# EAGLE design lund (EAGLE 5.10)

## Sheet 1 of 2
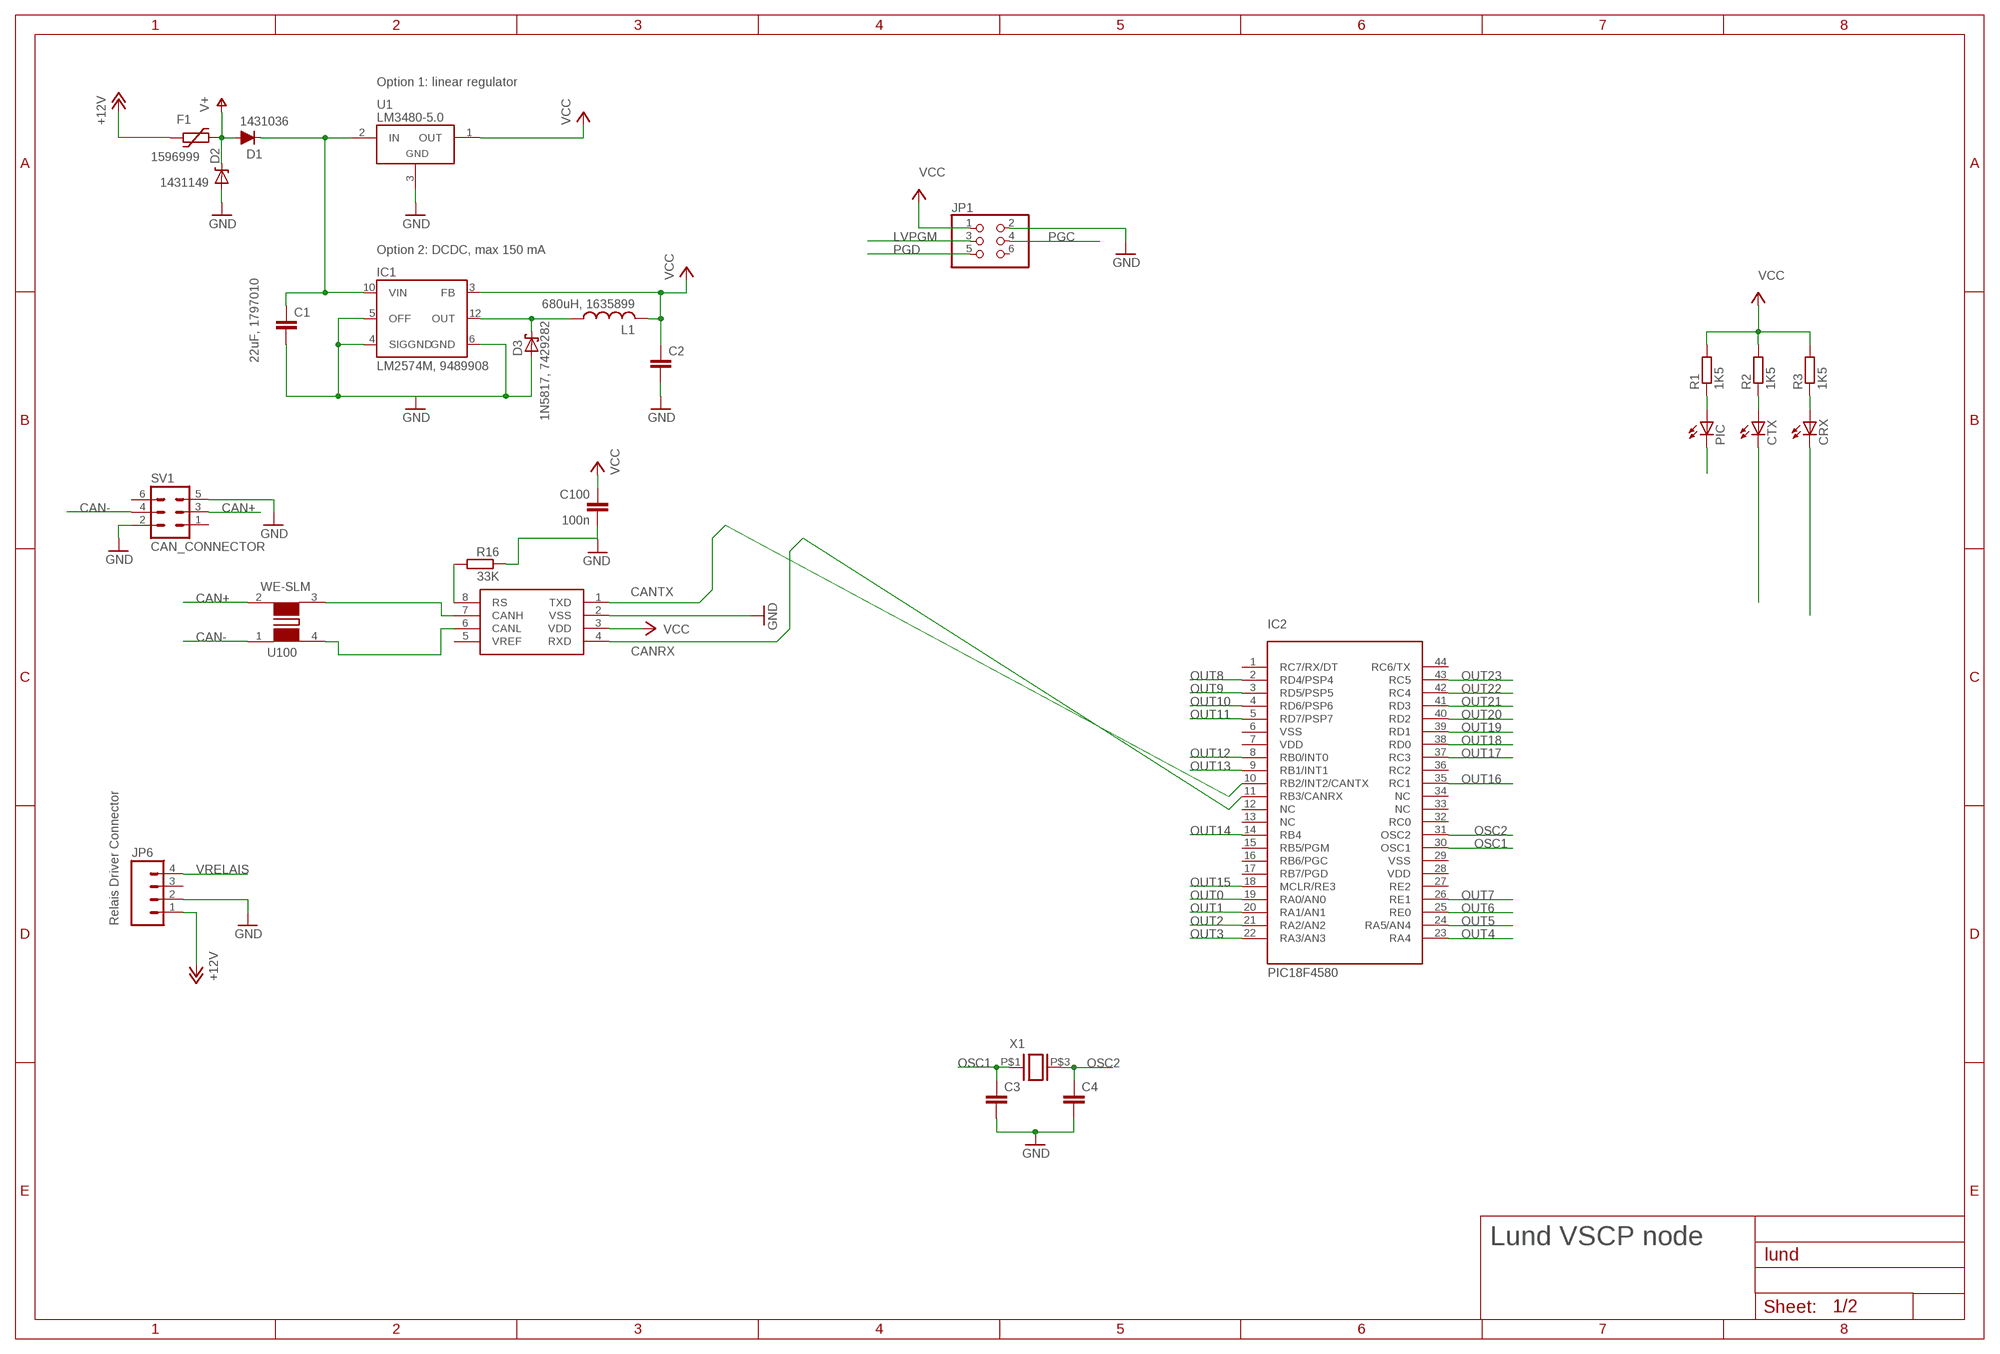
[diagram p0: schematic, sheet 1]

### Parts
C1  22uF, 1797010  C-EUC1206K  [C1206K]
C2  C-EUC1210K  [C1210K]
C3  CAP0603-CAP  [0603-CAP]
C4  CAP0603-CAP  [0603-CAP]
C100  100n  C-EUC0805  [C0805]
CRX  LEDCHIPLED_0805  [CHIPLED_0805]
CTX  LEDCHIPLED_0805  [CHIPLED_0805]
D1  1431036  D-FILL-SOD123  [SOD123]
D2  1431149  DIODE-ZENER403D-02  [403D-02]
D3  1N5817, 7429282  1N5817-B  [DO41-7.6]
F1  1596999  1812L  [1812L]
IC1  LM2574M, 9489908  LM2574M  [SO14W]
IC2  PIC18F4580  [TQFP44]
JP1  PINHD-2X3  [2X03]
JP6  M04SIDE_EDGE_5.08  [CAMDEN_BOSS_1X4_OPEN]
L1  680uH, 1635899  L-USWE-TPC  [POWER-CHOKE_WE-TPC]
PIC  LEDCHIPLED_0805  [CHIPLED_0805]
R1  1K5  R-EU_R0805  [R0805]
R2  1K5  R-EU_R0805  [R0805]
R3  1K5  R-EU_R0805  [R0805]
R16  33K  R-EU_R0805  [R0805]
SV1  CAN_CONNECTOR  ML6L  [ML6L]
U1  LM3480-5.0  [SOT-23-3]
U2  MCP2551  [SO08]
U100  WE-SLM  [WE-SLM]
X1  1611798  ABRACON_CRYSTAL  [QUARTZ_CRYSTAL]

### Nets
+12V: F1.P$1 JP6.1
CAN+: SV1.3 U100.2
CAN-: SV1.4 U100.1
CANRX: CRX.C IC2.11(RB3/CANRX) U2.4(RXD)
CANTX: CTX.C IC2.10(RB2/INT2/CANTX) U2.1(TXD)
GND: C2.2 C3.2 C4.2 C100.2 D2.P$2(A) JP1.2 JP6.2 R16.1 SV1.2 SV1.5 U1.3(GND) U2.2(VSS) ; also sheet 2
LVPGM: JP1.3
N$2: U2.7(CANH) U100.3
N$4: C1.1 D1.1(C) IC1.10(VIN) U1.2(IN)
N$7: R16.2 U2.8(RS)
N$9: C1.2 D3.A IC1.4(SIGGND) IC1.5(OFF) IC1.6(GND)
N$10: PIC.C
N$11: PIC.A R1.1
N$12: CTX.A R2.1
N$14: CRX.A R3.1
N$16: D3.C IC1.12(OUT) L1.1
N$25: U2.6(CANL) U100.4
OSC1: C3.1 IC2.30(OSC1) X1.P$1
OSC2: C4.1 IC2.31(OSC2) X1.P$3
OUT0: IC2.19(RA0/AN0) ; also sheet 2
OUT1: IC2.20(RA1/AN1) ; also sheet 2
OUT2: IC2.21(RA2/AN2) ; also sheet 2
OUT3: IC2.22(RA3/AN3) ; also sheet 2
OUT4: IC2.23(RA4) ; also sheet 2
OUT5: IC2.24(RA5/AN4) ; also sheet 2
OUT6: IC2.25(RE0) ; also sheet 2
OUT7: IC2.26(RE1) ; also sheet 2
OUT8: IC2.2(RD4/PSP4) ; also sheet 2
OUT9: IC2.3(RD5/PSP5) ; also sheet 2
OUT10: IC2.4(RD6/PSP6) ; also sheet 2
OUT11: IC2.5(RD7/PSP7) ; also sheet 2
OUT12: IC2.8(RB0/INT0) ; also sheet 2
OUT13: IC2.9(RB1/INT1) ; also sheet 2
OUT14: IC2.14(RB4) ; also sheet 2
OUT15: IC2.18(MCLR/RE3) ; also sheet 2
OUT16: IC2.35(RC1) ; also sheet 2
OUT17: IC2.37(RC3) ; also sheet 2
OUT18: IC2.38(RD0) ; also sheet 2
OUT19: IC2.39(RD1) ; also sheet 2
OUT20: IC2.40(RD2) ; also sheet 2
OUT21: IC2.41(RD3) ; also sheet 2
OUT22: IC2.42(RC4) ; also sheet 2
OUT23: IC2.43(RC5) ; also sheet 2
PGC: JP1.4
PGD: JP1.5
V+: D1.2(A) D2.P$1(C) F1.P$2
VCC: C2.1 C100.1 IC1.3(FB) JP1.1 L1.2 R1.2 R2.2 R3.2 U1.1(OUT) U2.3(VDD)
VRELAIS: JP6.4 ; also sheet 2
Unconnected: IC2.1(RC7/RX/DT) IC2.12(NC) IC2.13(NC) IC2.15(RB5/PGM) IC2.16(RB6/PGC) IC2.17(RB7/PGD) IC2.27(RE2) IC2.32(RC0) IC2.33(NC) IC2.34(NC) IC2.36(RC2) IC2.44(RC6/TX) JP1.6 JP6.3 SV1.1 SV1.6 U2.5(VREF)

### Notes on the sheet
- Option 1: linear regulator
- Option 2: DCDC, max 150 mA
- Relais Driver Connector
- Lund VSCP node

## Sheet 2 of 2
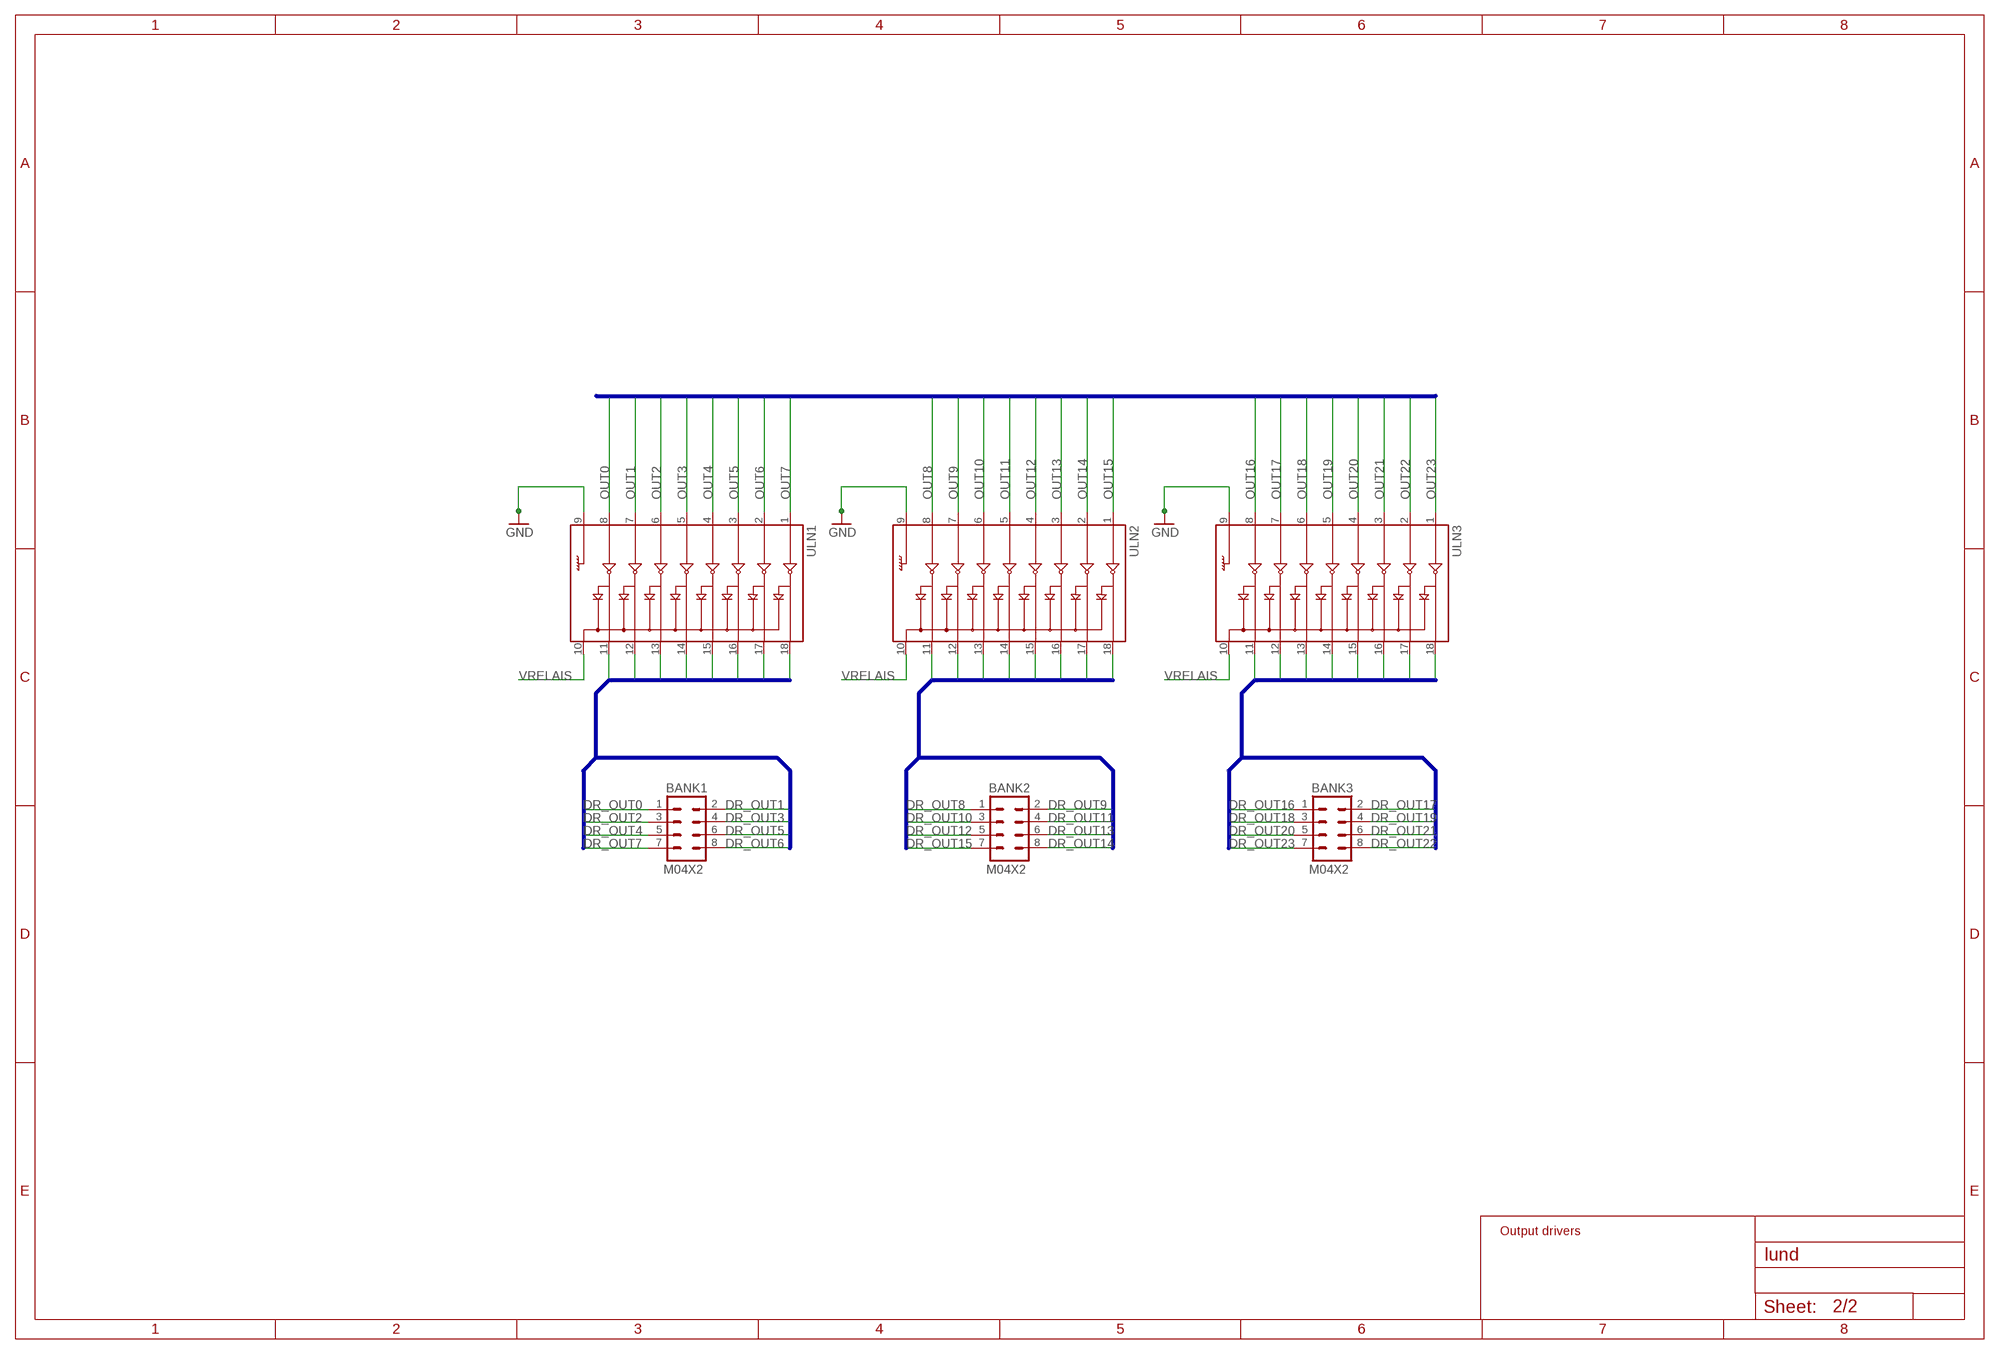
[diagram p1: schematic, sheet 2]

### Parts
BANK1  M04X2  [2X4]
BANK2  M04X2  [2X4]
BANK3  M04X2  [2X4]
ULN1  ULN2803SOIC  [SO018]
ULN2  ULN2803SOIC  [SO018]
ULN3  ULN2803SOIC  [SO018]

### Nets
DR_OUT0: BANK1.1 ULN1.11
DR_OUT1: BANK1.2 ULN1.12
DR_OUT2: BANK1.3 ULN1.13
DR_OUT3: BANK1.4 ULN1.14
DR_OUT4: BANK1.5 ULN1.15
DR_OUT5: BANK1.6 ULN1.16
DR_OUT6: BANK1.8 ULN1.17
DR_OUT7: BANK1.7 ULN1.18
DR_OUT8: BANK2.1 ULN2.11
DR_OUT9: BANK2.2 ULN2.12
DR_OUT10: BANK2.3 ULN2.13
DR_OUT11: BANK2.4 ULN2.14
DR_OUT12: BANK2.5 ULN2.15
DR_OUT13: BANK2.6 ULN2.16
DR_OUT14: BANK2.8 ULN2.17
DR_OUT15: BANK2.7 ULN2.18
DR_OUT16: BANK3.1 ULN3.11
DR_OUT17: BANK3.2 ULN3.12
DR_OUT18: BANK3.3 ULN3.13
DR_OUT19: BANK3.4 ULN3.14
DR_OUT20: BANK3.5 ULN3.15
DR_OUT21: BANK3.6 ULN3.16
DR_OUT22: BANK3.8 ULN3.17
DR_OUT23: BANK3.7 ULN3.18
GND: ULN1.9 ULN2.9 ULN3.9 ; also sheet 1
OUT0: ULN1.8 ; also sheet 1
OUT1: ULN1.7 ; also sheet 1
OUT2: ULN1.6 ; also sheet 1
OUT3: ULN1.5 ; also sheet 1
OUT4: ULN1.4 ; also sheet 1
OUT5: ULN1.3 ; also sheet 1
OUT6: ULN1.2 ; also sheet 1
OUT7: ULN1.1 ; also sheet 1
OUT8: ULN2.8 ; also sheet 1
OUT9: ULN2.7 ; also sheet 1
OUT10: ULN2.6 ; also sheet 1
OUT11: ULN2.5 ; also sheet 1
OUT12: ULN2.4 ; also sheet 1
OUT13: ULN2.3 ; also sheet 1
OUT14: ULN2.2 ; also sheet 1
OUT15: ULN2.1 ; also sheet 1
OUT16: ULN3.8 ; also sheet 1
OUT17: ULN3.7 ; also sheet 1
OUT18: ULN3.6 ; also sheet 1
OUT19: ULN3.5 ; also sheet 1
OUT20: ULN3.4 ; also sheet 1
OUT21: ULN3.3 ; also sheet 1
OUT22: ULN3.2 ; also sheet 1
OUT23: ULN3.1 ; also sheet 1
VRELAIS: ULN1.10 ULN2.10 ULN3.10 ; also sheet 1

### Buses
DR_OUT[0..7]
DR_OUT[8..15]
DR_OUT[16..23]
OUT[0..23]

### Notes on the sheet
- Output drivers

## Power pins joined to a net without a drawn wire
VDD: IC2.7(VDD) IC2.28(VDD)
VSS: IC2.6(VSS) IC2.29(VSS)

## Library data of the parts
BANK1-BANK3 = SparkFun:M04X2
C1 C2 C100 = rcl:C-EU: CAPACITOR, European symbol
C3 C4 = SparkFun:CAP: Capacitor Standard 0603 ceramic capacitor, and 0.1" leaded capacitor.
CRX CTX PIC = led:LED: LED OSRAM: - CHIPLED LG R971, LG N971, LY N971, LG Q971, LY Q971, LO R971, LY R971 LH N974, LH R974 LS Q976, LO Q976, LY Q976 LO Q996 - Hyper CHIPLED LW Q18S LB Q993, LB Q99A, LB R99A - SideLED LS A670, LO A670, LY A670, LG A670, LP A670 LB A673, LV A673, LT A673, LW A673 LH A674 LY A675 LS A676, LA A676, LO A676, LY A676, LW A676 LS A679, LY A679, LG A679 - Hyper Micro SIDELED® LS Y876, LA Y876, LO Y876, LY Y876 LT Y87S - SmartLED LW L88C, LW L88S LB L89C, LB L89S, LG L890 LS L89K, LO L89K, LY L89K LS L896, LA L896, LO L896, LY L896 - TOPLED LS T670, LO T670, LY T670, LG T670, LP T670 LSG T670, LSP T670, LSY T670, LOP T670, LYG T670 LG T671, LOG T671, LSG T671 LB T673, LV T673, LT T673, LW T673 LH T674 LS T676, LA T676, LO T676, LY T676, LB T676, LH T676, LSB T676, LW T676 LB T67C, LV T67C, LT T67C, LS T67K, LO T67K, LY T67K, LW E67C LS E67B, LA E67B, LO E67B, LY E67B, LB E67C, LV E67C, LT E67C LW T67C LS T679, LY T679, LG T679 LS T770, LO T770, LY T770, LG T770, LP T770 LB T773, LV T773, LT T773, LW T773 LH T774 LS E675, LA E675, LY E675, LS T675 LS T776, LA T776, LO T776, LY T776, LB T776 LHGB T686 LT T68C, LB T68C - Hyper Mini TOPLED® LB M676 - Mini TOPLED Santana® LG M470 LS M47K, LO M47K, LY M47K Source: http://www.osram.convergy.de LUXEON: - LUMILED® LXK2-PW12-R00, LXK2-PW12-S00, LXK2-PW14-U00, LXK2-PW14-V00 LXK2-PM12-R00, LXK2-PM12-S00, LXK2-PM14-U00 LXK2-PE12-Q00, LXK2-PE12-R00, LXK2-PE12-S00, LXK2-PE14-T00, LXK2-PE14-U00 LXK2-PB12-K00, LXK2-PB12-L00, LXK2-PB12-M00, LXK2-PB14-N00, LXK2-PB14-P00, LXK2-PB14-Q00 LXK2-PR12-L00, LXK2-PR12-M00, LXK2-PR14-Q00, LXK2-PR14-R00 LXK2-PD12-Q00, LXK2-PD12-R00, LXK2-PD12-S00 LXK2-PH12-R00, LXK2-PH12-S00 LXK2-PL12-P00, LXK2-PL12-Q00, LXK2-PL12-R00 Source: www.luxeon.com KINGBRIGHT: KA-3528ASYC Source: www.kingbright.com
D1 = semicon-smd-ipc:D-FILL-: DIODE filled
D2 = SparkFun:DIODE-ZENER: Zener Diode Production Part - 8199 3.4V Zener Voltage
D3 = diode:1N581*: 1.0A SCHOTTKY BARRIER RECTIFIER Source: http://www.diodes.com/datasheets/ds23001.pdf
F1 = ptc-littlefuse:1812L
IC1 = v-reg-3:LM2574: National Semiconductor <http://www.national.com> 0.5A "Simple Switcher"(c) 52kHz, Vout 1.23-37V (HV: 57V), Vin 40V (HV: 60V), 50µA standby current
IC2 = microchip:PIC18F4580
JP1 = pinhead:PINHD-2X3: PIN HEADER
JP6 = SparkFun:M04: Header 4 Standard 4-pin 0.1" header. Use with straight break away headers (SKU : PRT-00116), right angle break away headers (PRT-00553), swiss pins (PRT-00743), machine pins (PRT-00117), and female headers (PRT-00115). Molex polarized connector foot print use with SKU : PRT-08231 with associated crimp pins and housings.
L1 = rcl:L-US: INDUCTOR, American symbol
R1-R3 R16 = rcl:R-EU_: RESISTOR, European symbol
SV1 = con-harting-ml:ML6: HARTING
U1 = regulators:LM3480-*: National Semiconductor LM3480 100 mA, SOT-23, quasi-LDO linear regulator
U2 = SparkFun:MCP2551
U100 = wuerth-elektronik:WE-SLM
ULN1-ULN3 = SparkFun:ULN2803: Darlington Driver ULN2803 Darlington array. 500mA max per channel, 8-channel package. Spark Fun Electronics SKU : COM-00312
X1 = SparkFun:ABRACON_CRYSTAL

## Board
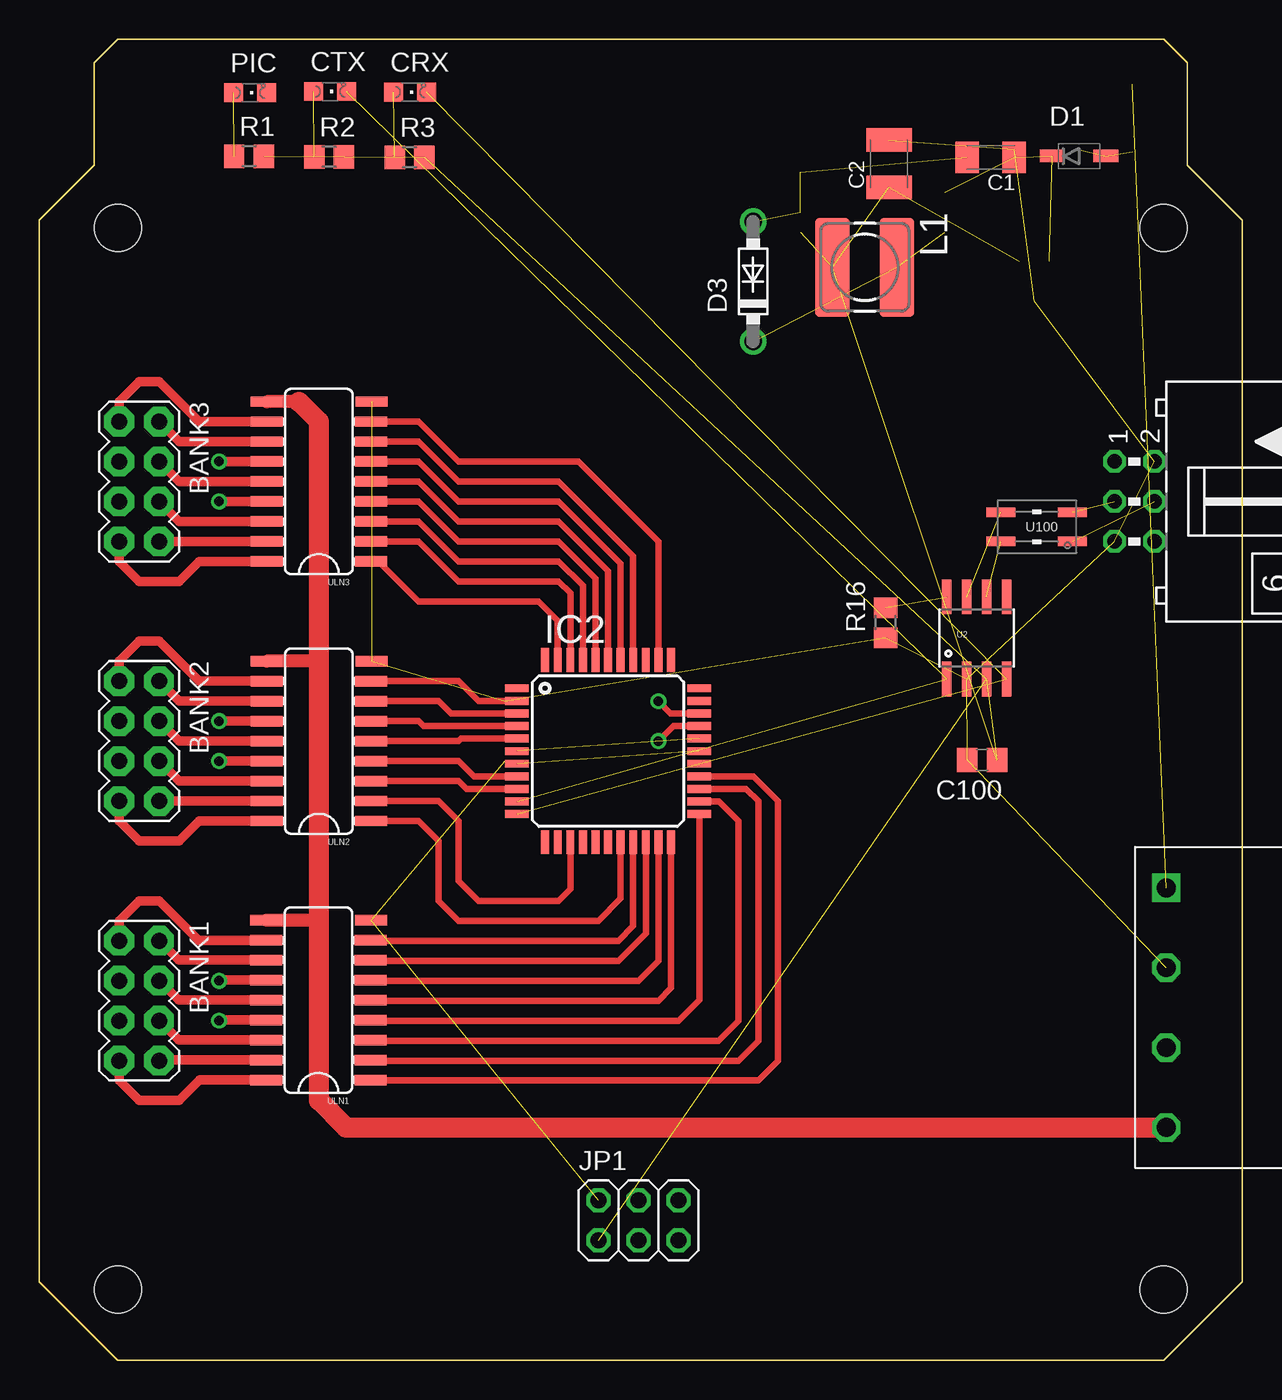
[diagram p2: board, top side]
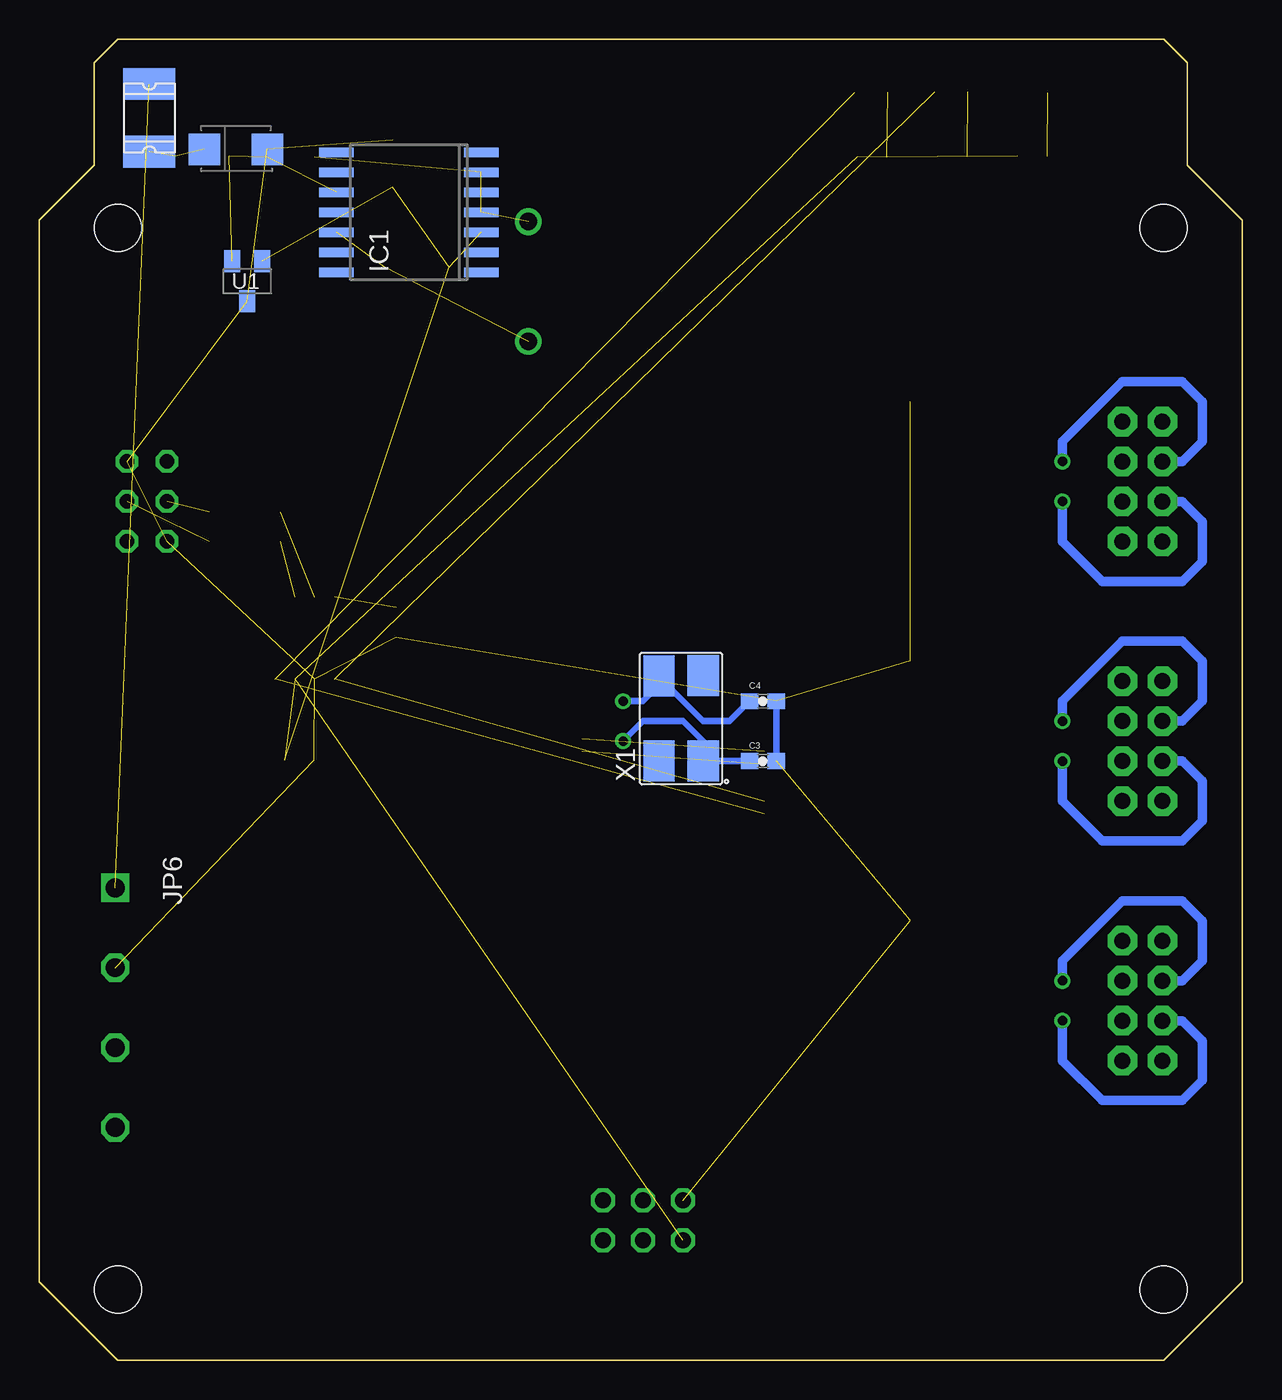
[diagram p3: board, bottom side, seen from below]

Size 76.5 x 84 mm. Coordinates in mm from the lower left corner, seen from the top.
Outline: 5,0 0,5 0,72.5 3.5,76 3.5,82.5 5,84 71.5,84 73,82.5 73,76 76.5,72.5 76.5,5 71.5,0 5,0
Copper layers (1*16): Top 0.035mm / dielectric 1.5mm / Bottom 0.035mm
Design rules "default": minimum track width 10mil, minimum drill 24mil, track to track 8mil, track to pad 8mil, pad to pad 8mil, via to via 8mil, smd to smd 8mil, copper to edge 40mil, drill to drill 8mil, minimum pad ring 10mil, minimum via ring 8mil, stop-mask expansion 4mil, vias tented up to drill 0mil, thermal gap 10mil
Holes 3 mm at 5,4.5 71.5,4.5 71.5,72 5,72

### Footprints (pad centres in the part's own frame; a part is rotated, then mirrored left to right if it is on the bottom)
2X4 = drill 1.016 pad 1.88 octagon: 1 -3.81,-1.27; 2 -3.81,1.27; 3 -1.27,-1.27; 4 -1.27,1.27; 5 1.27,-1.27; 6 1.27,1.27; 7 3.81,-1.27; 8 3.81,1.27
C1206K = smd 1.5 x 2: 1 -1.5,0; 2 1.5,0
C1210K = smd 1.5 x 2.9: 1 -1.5,0; 2 1.5,0
0603-CAP = smd 1.1 x 1: 1 -0.85,0; 2 0.85,0
C0805 = smd 1.3 x 1.5: 1 -0.95,0; 2 0.95,0
CHIPLED_0805 = smd 1.2 x 1.2: A 0,-1.05; C 0,1.05
SOD123 = smd 1.6 x 0.8: 1 -1.7,0; 2 1.7,0
403D-02 = smd 2 x 2: P$1 0,0; P$2 4,0
DO41-7.6 = drill 1.1 pad 1.7 round: A 3.81,0; C -3.81,0
1812L = smd 2.03 x 3.3: P$1 -2.16,0; P$2 2.16,0
SO14W = smd 0.6 x 2.2: 1 -3.81,-4.6; 2 -2.54,-4.6; 3 -1.27,-4.6; 4 0,-4.6; 5 1.27,-4.6; 6 2.54,-4.6; 7 3.81,-4.6; 8 3.81,4.6; 9 2.54,4.6; 10 1.27,4.6; 11 0,4.6; 12 -1.27,4.6; 13 -2.54,4.6; 14 -3.81,4.6
TQFP44 = smd 1.5 x 0.5: 1 -5.8,4; 2 -5.8,3.2; 3 -5.8,2.4; 4 -5.8,1.6; 5 -5.8,0.8; 6 -5.8,0; 7 -5.8,-0.8; 8 -5.8,-1.6; 9 -5.8,-2.4; 10 -5.8,-3.2; 11 -5.8,-4; 23 5.8,-4; 24 5.8,-3.2; 25 5.8,-2.4; 26 5.8,-1.6; 27 5.8,-0.8; 28 5.8,0; 29 5.8,0.8; 30 5.8,1.6; 31 5.8,2.4; 32 5.8,3.2; 33 5.8,4 | smd 0.5 x 1.5: 12 -4,-5.8; 13 -3.2,-5.8; 14 -2.4,-5.8; 15 -1.6,-5.8; 16 -0.8,-5.8; 17 0,-5.8; 18 0.8,-5.8; 19 1.6,-5.8; 20 2.4,-5.8; 21 3.2,-5.8; 22 4,-5.8; 34 4,5.8; 35 3.2,5.8; 36 2.4,5.8; 37 1.6,5.8; 38 0.8,5.8; 39 0,5.8; 40 -0.8,5.8; 41 -1.6,5.8; 42 -2.4,5.8; 43 -3.2,5.8; 44 -4,5.8
2X03 = drill 1.016 octagon: 1 -2.54,-1.27; 2 -2.54,1.27; 3 0,-1.27; 4 0,1.27; 5 2.54,-1.27; 6 2.54,1.27
CAMDEN_BOSS_1X4_OPEN = drill 1.2 square: 1 0,0 | drill 1.2 octagon: 2 5.08,0; 3 10.16,0; 4 15.24,0
POWER-CHOKE_WE-TPC = smd 6.3 x 2.2: 1 0,2.05; 2 0,-2.05
R0805 = smd 1.3 x 1.5: 1 -0.95,0; 2 0.95,0
ML6L = drill 0.914 octagon: 1 -2.54,-1.27; 2 -2.54,1.27; 3 0,-1.27; 4 0,1.27; 5 2.54,-1.27; 6 2.54,1.27
SOT-23-3 = smd 1.016 x 1.397: 1 -0.953,-1.27; 2 0.953,-1.27; 3 0,1.27
SO08 = smd 0.61 x 2.21: 1 -1.905,-2.616; 2 -0.635,-2.616; 3 0.635,-2.616; 4 1.905,-2.616; 5 1.905,2.616; 6 0.635,2.616; 7 -0.635,2.616; 8 -1.905,2.616
WE-SLM = smd 0.6 x 1.85: 1 0.932,2.268; 2 -0.932,2.268; 3 -0.932,-2.294; 4 0.932,-2.294
SO018 = smd 0.66 x 2.032: 1 -5.08,-3.315; 2 -3.81,-3.315; 3 -2.54,-3.315; 4 -1.27,-3.315; 5 0,-3.315; 6 1.27,-3.315; 7 2.54,-3.315; 8 3.81,-3.315; 9 5.08,-3.353; 10 5.08,3.315; 11 3.81,3.315; 12 2.54,3.315; 13 1.27,3.315; 14 0,3.315; 15 -1.27,3.315; 16 -2.54,3.315; 17 -3.81,3.315; 18 -5.08,3.315
QUARTZ_CRYSTAL = smd 2.6 x 2: P$1 0,0; P$2 5.45,0; P$3 5.4,2.8; P$4 0,2.8

### Placement (x,y rotation side)
BANK1  6.35,22.86 270 top
BANK2  6.35,39.37 270 top
BANK3  6.35,55.88 270 top
C1  60.5,76.5 180 top
C2  54.04,76.09 90 top
C3  30.48,38.1 0 bottom
C4  30.48,41.91 0 bottom
C100  59.96,38.17 180 top
CRX  23.58,80.64 270 top
CTX  18.5,80.68 270 top
D1  66.12,76.57 0 top
D2  66,77 0 bottom
D3  45.4,68.6 90 top
F1  69.5,79 270 bottom
IC1  53,73 90 bottom
IC2  36.17,38.73 0 top
JP1  38.1,8.89 0 top
JP6  71.67,30.04 270 bottom
L1  52.5,69.5 270 top
PIC  13.4,80.6 270 top
R1  13.34,76.56 0 top
R2  18.43,76.52 0 top
R3  23.55,76.5 0 top
R16  53.82,46.9 90 top
SV1  69.65,54.61 270 top
U1  63.28,68.61 180 bottom
U2  59.61,45.93 0 top
U100  63.44,53 270 top
ULN1  17.75,22.9 90 top
ULN2  17.78,39.37 90 top
ULN3  17.78,55.88 90 top
X1  34.29,38.1 90 bottom

### Tracks (layer width: path | path; a pad name or v marks a point on that pad's centre or on a via)
+12V  (1 unrouted)
CAN+  (1 unrouted)
CAN-  (1 unrouted)
CANRX  (2 unrouted)
CANTX  (2 unrouted)
DR_OUT0
  Top 0.61: ULN1.11 10.12,26.71 7.62,29.21 6.35,29.21 5.08,27.94 BANK1.1
DR_OUT1
  Top 0.61: ULN1.12 8.85,25.44 BANK1.2
DR_OUT2  (via drill 0.6)
  Top 0.61: ULN1.13 11.47,24.17 v11.43,24.13
  Bottom 0.61: v11.43,24.13 11.43,25.4 7.62,29.21 3.81,29.21 2.54,27.94 2.54,25.4 3.81,24.13 BANK1.3
DR_OUT3
  Top 0.61: ULN1.14 8.85,22.9 BANK1.4
DR_OUT4  (via drill 0.6)
  Top 0.61: ULN1.15 11.47,21.63 v11.43,21.59
  Bottom 0.61: v11.43,21.59 11.43,19.05 8.89,16.51 3.81,16.51 2.54,17.78 2.54,20.32 3.81,21.59 BANK1.5
DR_OUT5
  Top 0.61: ULN1.16 8.85,20.36 BANK1.6
DR_OUT6
  Top 0.61: ULN1.17 7.66,19.09 BANK1.8
DR_OUT7
  Top 0.61: ULN1.18 10.2,17.82 8.89,16.51 6.35,16.51 5.08,17.78 BANK1.7
DR_OUT8
  Top 0.61: ULN2.11 10.16,43.18 7.62,45.72 6.35,45.72 5.08,44.45 BANK2.1
DR_OUT9
  Top 0.61: ULN2.12 8.89,41.91 BANK2.2
DR_OUT10  (via drill 0.6)
  Top 0.61: ULN2.13 v11.43,40.64
  Bottom 0.61: v11.43,40.64 11.43,41.91 7.62,45.72 3.81,45.72 2.54,44.45 2.54,41.91 3.81,40.64 BANK2.3
DR_OUT11
  Top 0.61: ULN2.14 8.89,39.37 BANK2.4
DR_OUT12  (via drill 0.6)
  Top 0.61: ULN2.15 v11.43,38.1
  Bottom 0.61: v11.43,38.1 11.43,35.56 8.89,33.02 3.81,33.02 2.54,34.29 2.54,36.83 3.81,38.1 BANK2.5
DR_OUT13
  Top 0.61: ULN2.16 8.89,36.83 BANK2.6
DR_OUT14
  Top 0.61: ULN2.17 BANK2.8
DR_OUT15
  Top 0.61: ULN2.18 10.16,34.29 8.89,33.02 6.35,33.02 5.08,34.29 BANK2.7
DR_OUT16
  Top 0.61: ULN3.11 10.16,59.69 7.62,62.23 6.35,62.23 5.08,60.96 BANK3.1
DR_OUT17
  Top 0.61: ULN3.12 8.89,58.42 BANK3.2
DR_OUT18  (via drill 0.6)
  Top 0.61: ULN3.13 v11.43,57.15
  Bottom 0.61: v11.43,57.15 11.43,58.42 7.62,62.23 3.81,62.23 2.54,60.96 2.54,58.42 3.81,57.15 BANK3.3
DR_OUT19
  Top 0.61: ULN3.14 8.89,55.88 BANK3.4
DR_OUT20  (via drill 0.6)
  Top 0.61: ULN3.15 v11.43,54.61
  Bottom 0.61: v11.43,54.61 11.43,52.07 8.89,49.53 3.81,49.53 2.54,50.8 2.54,53.34 3.81,54.61 BANK3.5
DR_OUT21
  Top 0.61: ULN3.16 8.89,53.34 BANK3.6
DR_OUT22
  Top 0.61: ULN3.17 BANK3.8
DR_OUT23
  Top 0.61: ULN3.18 10.16,50.8 8.89,49.53 6.35,49.53 5.08,50.8 BANK3.7
GND  (13 unrouted)
  Bottom 0.406: C3.2 C4.2
N$2  (1 unrouted)
N$4  (3 unrouted)
N$7  (1 unrouted)
N$9  (4 unrouted)
N$11  (1 unrouted)
N$12  (1 unrouted)
N$14  (1 unrouted)
N$16  (2 unrouted)
N$25  (1 unrouted)
OSC1  (via drill 0.6)
  Top 0.406: IC2.30 40.33,40.33 v39.37,39.37
  Bottom 0.406: v39.37,39.37 38.1,40.64 35.56,40.64 34.29,39.37 X1.P$1 C3.1
OSC2  (via drill 0.6)
  Top 0.406: IC2.31 40.15,41.13 v39.37,41.91
  Bottom 0.406: v39.37,41.91 38.1,41.91 36.83,43.18 36.83,43.24 X1.P$3 37.09,43.44 34.29,40.64 32.6,40.64 C4.1
OUT0
  Top 0.406: IC2.19 37.77,27.61 36.83,26.67 21.11,26.67 ULN1.8
OUT1
  Top 0.406: IC2.20 38.57,27.14 36.83,25.4 21.11,25.4 ULN1.7
OUT2
  Top 0.406: IC2.21 39.37,25.4 38.1,24.13 21.11,24.13 ULN1.6
OUT3
  Top 0.406: IC2.22 40.17,23.66 39.37,22.86 21.11,22.86 ULN1.5
OUT4
  Top 0.406: IC2.23 41.97,22.92 40.64,21.59 21.11,21.59 ULN1.4
OUT5
  Top 0.406: IC2.24 43.21,35.53 44.45,34.29 44.45,21.59 43.18,20.32 21.11,20.32 ULN1.3
OUT6
  Top 0.406: IC2.25 44.95,36.33 45.72,35.56 45.72,20.32 44.45,19.05 21.11,19.05 ULN1.2
OUT7
  Top 0.406: IC2.26 45.42,37.13 46.99,35.56 46.99,19.05 45.72,17.78 21.11,17.78 ULN1.1
OUT8
  Top 0.406: IC2.2 27.92,41.93 26.67,43.18 ULN2.8
OUT9
  Top 0.406: IC2.3 26.18,41.13 25.4,41.91 ULN2.7
OUT10
  Top 0.406: IC2.4 24.44,40.33 24.13,40.64 ULN2.6
OUT11
  Top 0.406: IC2.5 26.83,39.53 26.67,39.37 ULN2.5
OUT12
  Top 0.406: IC2.8 27.64,37.13 26.67,38.1 ULN2.4
OUT13
  Top 0.406: IC2.9 27.17,36.33 26.67,36.83 ULN2.3
OUT14
  Top 0.406: IC2.14 33.77,29.96 33.02,29.21 27.94,29.21 26.67,30.48 26.67,34.29 25.4,35.56 ULN2.2
OUT15
  Top 0.406: IC2.18 36.97,29.35 35.56,27.94 26.67,27.94 25.4,29.21 25.4,33.02 24.13,34.29 ULN2.1
OUT16
  Top 0.406: IC2.35 39.37,52.07 34.29,57.15 26.67,57.15 24.13,59.69 ULN3.8
OUT17
  Top 0.406: IC2.37 37.77,51.13 33.02,55.88 26.67,55.88 24.13,58.42 ULN3.7
OUT18
  Top 0.406: IC2.38 36.97,50.66 33.02,54.61 26.67,54.61 24.13,57.15 ULN3.6
OUT19
  Top 0.406: IC2.39 36.17,50.19 33.02,53.34 26.67,53.34 24.13,55.88 ULN3.5
OUT20
  Top 0.406: IC2.40 35.37,49.72 33.02,52.07 26.67,52.07 24.13,54.61 ULN3.4
OUT21
  Top 0.406: IC2.41 34.57,49.25 33.02,50.8 26.67,50.8 24.13,53.34 ULN3.3
OUT22
  Top 0.406: IC2.42 33.77,48.78 33.02,49.53 26.67,49.53 24.13,52.07 ULN3.2
OUT23
  Top 0.406: IC2.43 32.97,47.04 31.75,48.26 24.13,48.26 21.59,50.8 ULN3.1
V+  (2 unrouted)
VCC  (9 unrouted)
VDD  (1 unrouted)
VRELAIS
  Top 0.813: 17.78,44.45 ULN2.10 | 16.51,60.96 ULN3.10 | ULN1.10 17.74,27.98 17.78,27.94
  Top 1.27: JP6.4 19.49,14.8 17.78,16.51 17.78,27.94 17.78,44.45 17.78,59.69 16.51,60.96
VSS  (1 unrouted)